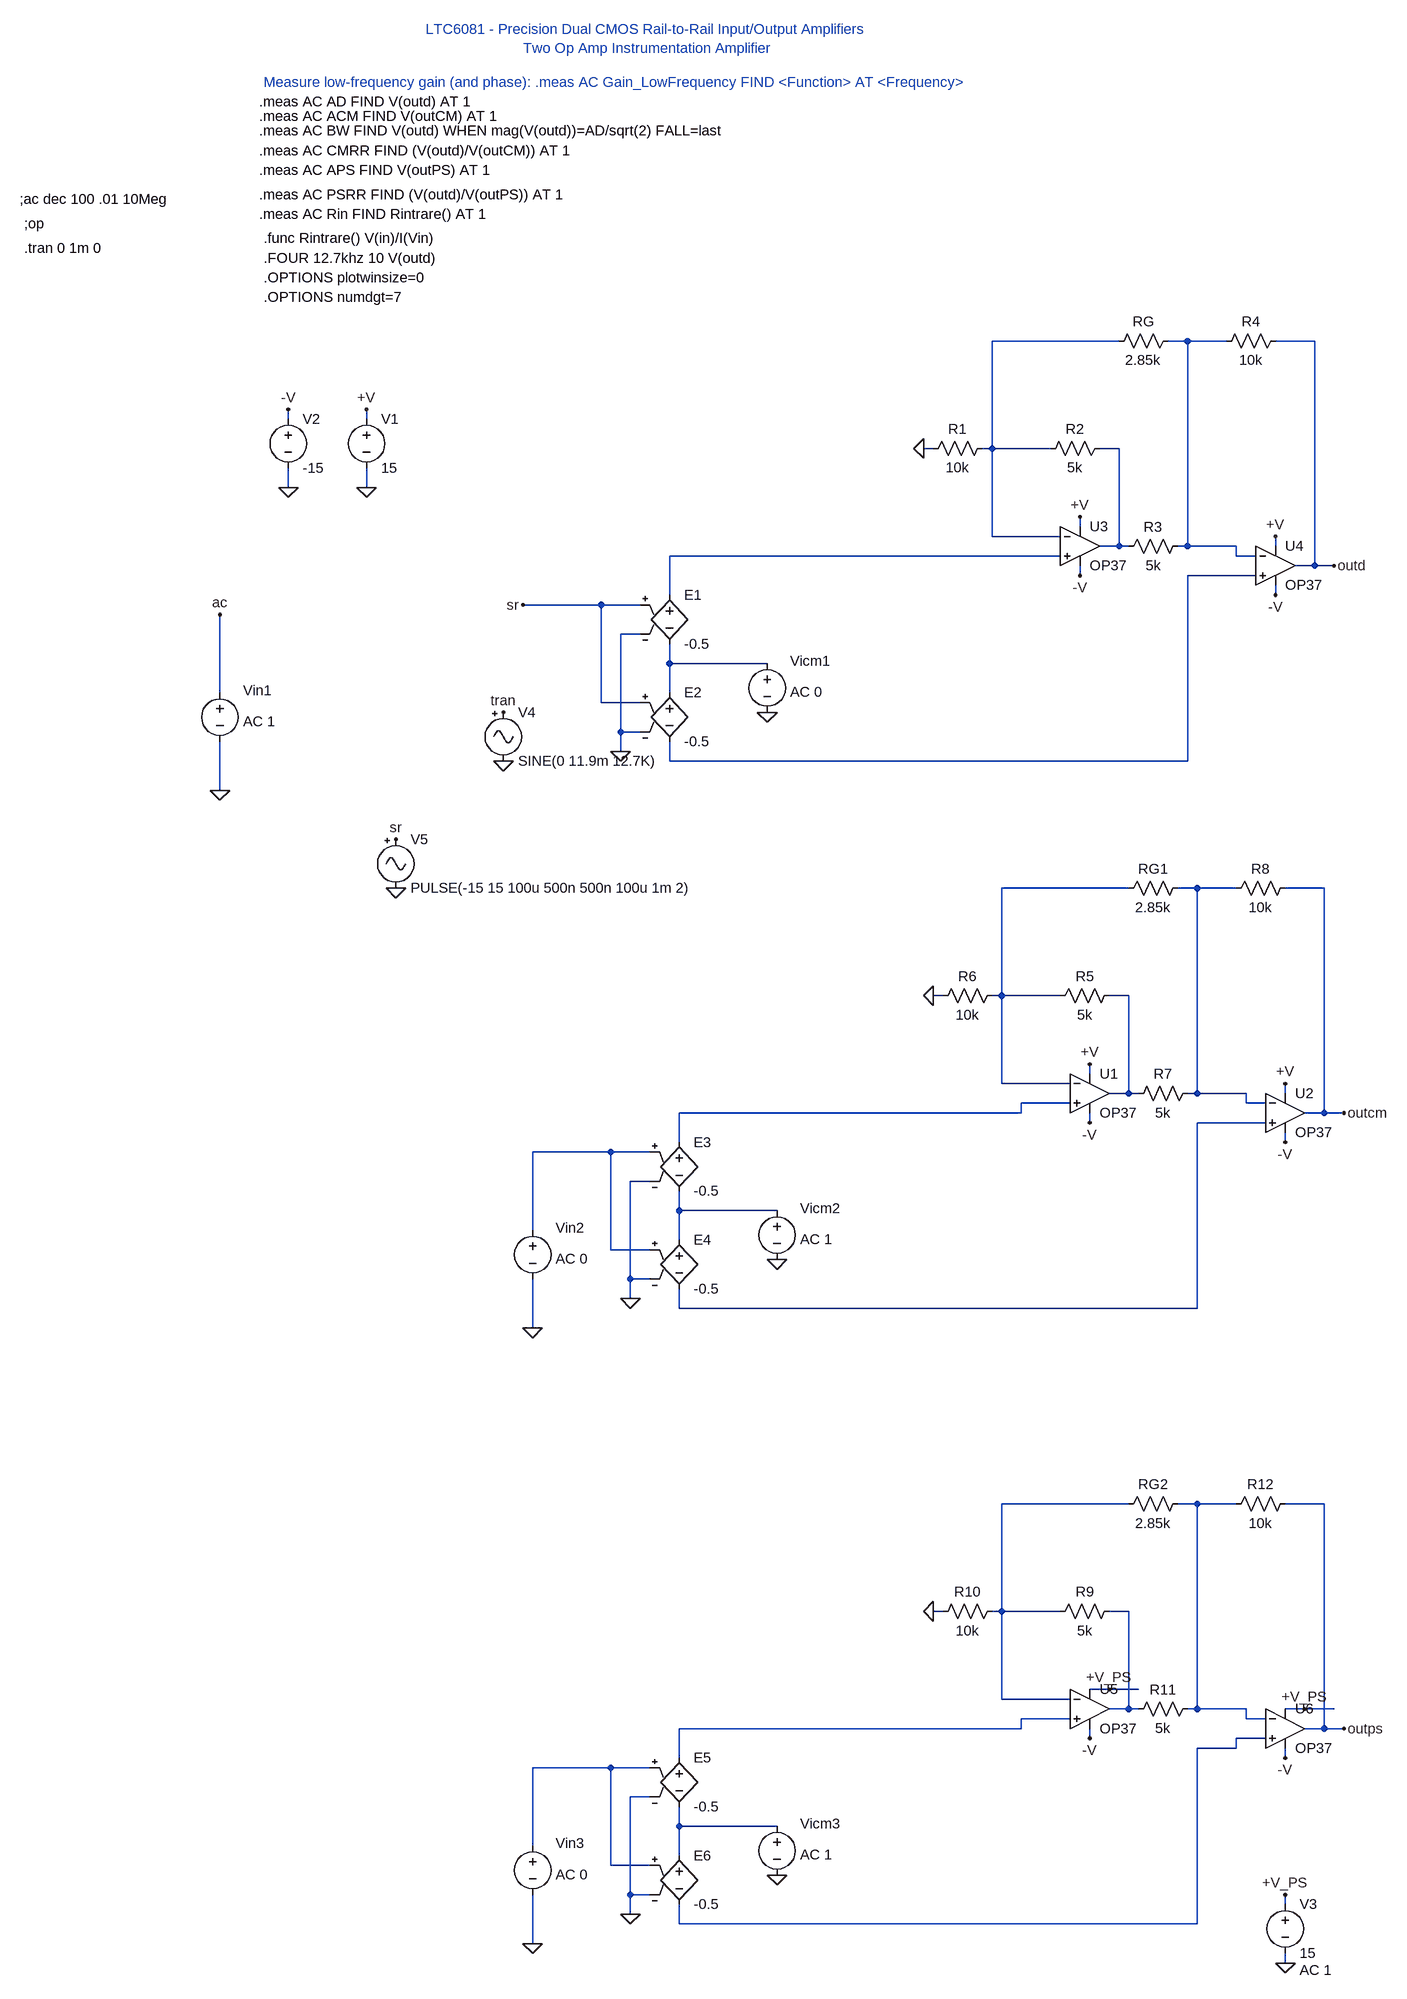
[diagram p0: schematic ai.asc]
ai.asc, the LTspice schematic file:
Version 4
SHEET 1 1248 2588
WIRE 272 -96 64 -96
WIRE 384 -96 352 -96
WIRE 448 -96 384 -96
WIRE 592 -96 528 -96
WIRE -1088 32 -1088 16
WIRE -960 32 -960 16
WIRE -32 80 -48 80
WIRE 64 80 64 -96
WIRE 64 80 48 80
WIRE 160 80 64 80
WIRE 272 80 240 80
WIRE -1088 144 -1088 112
WIRE -960 144 -960 112
WIRE 208 208 208 192
WIRE 64 224 64 80
WIRE 176 224 64 224
WIRE 272 240 272 80
WIRE 272 240 240 240
WIRE 288 240 272 240
WIRE 384 240 384 -96
WIRE 384 240 368 240
WIRE 464 240 384 240
WIRE 528 240 528 224
WIRE 176 256 -464 256
WIRE 464 256 464 240
WIRE 496 256 464 256
WIRE 592 272 592 -96
WIRE 592 272 560 272
WIRE 624 272 592 272
WIRE 208 288 208 272
WIRE 496 288 384 288
WIRE -464 320 -464 256
WIRE 528 320 528 304
WIRE -576 336 -704 336
WIRE -512 336 -576 336
WIRE -512 384 -544 384
WIRE -464 432 -464 400
WIRE -304 432 -464 432
WIRE -1200 480 -1200 352
WIRE -464 480 -464 432
WIRE -576 496 -576 336
WIRE -512 496 -576 496
WIRE -544 544 -544 384
WIRE -512 544 -544 544
WIRE -544 576 -544 544
WIRE -464 592 -464 560
WIRE 384 592 384 288
WIRE 384 592 -464 592
WIRE -1200 640 -1200 560
WIRE 288 800 80 800
WIRE 400 800 368 800
WIRE 464 800 400 800
WIRE 608 800 544 800
WIRE -16 976 -32 976
WIRE 80 976 80 800
WIRE 80 976 64 976
WIRE 176 976 80 976
WIRE 288 976 256 976
WIRE 224 1104 224 1088
WIRE 80 1120 80 976
WIRE 192 1120 80 1120
WIRE 288 1136 288 976
WIRE 288 1136 256 1136
WIRE 304 1136 288 1136
WIRE 400 1136 400 800
WIRE 400 1136 384 1136
WIRE 480 1136 400 1136
WIRE 544 1136 544 1120
WIRE 192 1152 112 1152
WIRE 480 1152 480 1136
WIRE 512 1152 480 1152
WIRE 112 1168 112 1152
WIRE 112 1168 -448 1168
WIRE 608 1168 608 800
WIRE 608 1168 576 1168
WIRE 640 1168 608 1168
WIRE 224 1184 224 1168
WIRE 512 1184 400 1184
WIRE -448 1216 -448 1168
WIRE 544 1216 544 1200
WIRE -560 1232 -688 1232
WIRE -496 1232 -560 1232
WIRE -496 1280 -528 1280
WIRE -448 1328 -448 1296
WIRE -288 1328 -448 1328
WIRE -688 1360 -688 1232
WIRE -448 1376 -448 1328
WIRE -560 1392 -560 1232
WIRE -496 1392 -560 1392
WIRE -528 1440 -528 1280
WIRE -496 1440 -528 1440
WIRE -528 1472 -528 1440
WIRE -448 1488 -448 1456
WIRE 400 1488 400 1184
WIRE 400 1488 -448 1488
WIRE -688 1520 -688 1440
WIRE 288 1808 80 1808
WIRE 400 1808 368 1808
WIRE 464 1808 400 1808
WIRE 608 1808 544 1808
WIRE -16 1984 -32 1984
WIRE 80 1984 80 1808
WIRE 80 1984 64 1984
WIRE 176 1984 80 1984
WIRE 288 1984 256 1984
WIRE 256 2112 224 2112
WIRE 304 2112 256 2112
WIRE 80 2128 80 1984
WIRE 192 2128 80 2128
WIRE 288 2144 288 1984
WIRE 288 2144 256 2144
WIRE 304 2144 288 2144
WIRE 400 2144 400 1808
WIRE 400 2144 384 2144
WIRE 480 2144 400 2144
WIRE 576 2144 544 2144
WIRE 624 2144 576 2144
WIRE 192 2160 112 2160
WIRE 480 2160 480 2144
WIRE 512 2160 480 2160
WIRE 112 2176 112 2160
WIRE 112 2176 -448 2176
WIRE 608 2176 608 1808
WIRE 608 2176 576 2176
WIRE 640 2176 608 2176
WIRE 224 2192 224 2176
WIRE 512 2192 464 2192
WIRE 464 2208 464 2192
WIRE 464 2208 400 2208
WIRE -448 2224 -448 2176
WIRE 544 2224 544 2208
WIRE -560 2240 -688 2240
WIRE -496 2240 -560 2240
WIRE -496 2288 -528 2288
WIRE -448 2336 -448 2304
WIRE -288 2336 -448 2336
WIRE -688 2368 -688 2240
WIRE -448 2384 -448 2336
WIRE -560 2400 -560 2240
WIRE -496 2400 -560 2400
WIRE -528 2448 -528 2288
WIRE -496 2448 -528 2448
WIRE 544 2464 544 2448
WIRE -528 2480 -528 2448
WIRE -448 2496 -448 2464
WIRE 400 2496 400 2208
WIRE 400 2496 -448 2496
WIRE -688 2528 -688 2448
WIRE 544 2560 544 2544
FLAG -960 144 0
FLAG 208 192 +V
FLAG -960 16 +V
FLAG 208 288 -V
FLAG -1088 144 0
FLAG -1088 16 -V
FLAG -48 80 0
FLAG 528 224 +V
FLAG 528 320 -V
FLAG 624 272 outd
FLAG -1200 640 0
FLAG -544 576 0
FLAG -304 512 0
FLAG 224 1088 +V
FLAG 224 1184 -V
FLAG -32 976 0
FLAG 544 1120 +V
FLAG 544 1216 -V
FLAG 640 1168 outcm
FLAG -688 1520 0
FLAG -528 1472 0
FLAG -288 1408 0
FLAG 224 2192 -V
FLAG -32 1984 0
FLAG 544 2224 -V
FLAG 640 2176 outps
FLAG -688 2528 0
FLAG -528 2480 0
FLAG -288 2416 0
FLAG 544 2560 0
FLAG 544 2448 +V_PS
FLAG 576 2144 +V_PS
FLAG 256 2112 +V_PS
FLAG -1200 352 ac
FLAG -736 512 tran
FLAG -736 592 0
FLAG -912 800 0
FLAG -912 720 sr
FLAG -704 336 sr
SYMBOL voltage -960 16 R0
WINDOW 123 0 0 Left 2
WINDOW 39 0 0 Left 2
SYMATTR InstName V1
SYMATTR Value 15
SYMBOL voltage -1088 16 R0
WINDOW 123 0 0 Left 2
WINDOW 39 0 0 Left 2
SYMATTR InstName V2
SYMATTR Value -15
SYMBOL res 256 64 R90
WINDOW 0 0 56 VBottom 2
WINDOW 3 32 56 VTop 2
SYMATTR InstName R2
SYMATTR Value 5k
SYMBOL res 64 64 R90
WINDOW 0 0 56 VBottom 2
WINDOW 3 32 56 VTop 2
SYMATTR InstName R1
SYMATTR Value 10k
SYMBOL res 368 -112 R90
WINDOW 0 0 56 VBottom 2
WINDOW 3 32 56 VTop 2
SYMATTR InstName RG
SYMATTR Value 2.85k
SYMBOL res 384 224 R90
WINDOW 0 0 56 VBottom 2
WINDOW 3 32 56 VTop 2
SYMATTR InstName R3
SYMATTR Value 5k
SYMBOL res 544 -112 R90
WINDOW 0 0 56 VBottom 2
WINDOW 3 32 56 VTop 2
SYMATTR InstName R4
SYMATTR Value 10k
SYMBOL voltage -1200 464 R0
WINDOW 123 38 63 Left 2
WINDOW 39 0 0 Left 2
WINDOW 0 38 12 Left 2
WINDOW 3 -188 38 Left 2
SYMATTR Value2 AC 1
SYMATTR InstName Vin1
SYMATTR Value ""
SYMBOL e -464 304 R0
SYMATTR InstName E1
SYMATTR Value -0.5
SYMBOL e -464 464 R0
SYMATTR InstName E2
SYMATTR Value -0.5
SYMBOL voltage -304 416 R0
WINDOW 123 38 63 Left 2
WINDOW 39 0 0 Left 2
WINDOW 0 38 12 Left 2
WINDOW 3 -188 38 Left 2
SYMATTR Value2 AC 0
SYMATTR InstName Vicm1
SYMATTR Value ""
SYMBOL res 272 960 R90
WINDOW 0 0 56 VBottom 2
WINDOW 3 32 56 VTop 2
SYMATTR InstName R5
SYMATTR Value 5k
SYMBOL res 80 960 R90
WINDOW 0 0 56 VBottom 2
WINDOW 3 32 56 VTop 2
SYMATTR InstName R6
SYMATTR Value 10k
SYMBOL res 384 784 R90
WINDOW 0 0 56 VBottom 2
WINDOW 3 32 56 VTop 2
SYMATTR InstName RG1
SYMATTR Value 2.85k
SYMBOL res 400 1120 R90
WINDOW 0 0 56 VBottom 2
WINDOW 3 32 56 VTop 2
SYMATTR InstName R7
SYMATTR Value 5k
SYMBOL res 560 784 R90
WINDOW 0 0 56 VBottom 2
WINDOW 3 32 56 VTop 2
SYMATTR InstName R8
SYMATTR Value 10k
SYMBOL voltage -688 1344 R0
WINDOW 123 38 63 Left 2
WINDOW 39 0 0 Left 2
WINDOW 0 38 12 Left 2
WINDOW 3 -188 38 Left 2
SYMATTR Value2 AC 0
SYMATTR InstName Vin2
SYMATTR Value ""
SYMBOL e -448 1200 R0
SYMATTR InstName E3
SYMATTR Value -0.5
SYMBOL e -448 1360 R0
SYMATTR InstName E4
SYMATTR Value -0.5
SYMBOL voltage -288 1312 R0
WINDOW 123 38 63 Left 2
WINDOW 39 0 0 Left 2
WINDOW 0 38 12 Left 2
WINDOW 3 -188 38 Left 2
SYMATTR Value2 AC 1
SYMATTR InstName Vicm2
SYMATTR Value ""
SYMBOL res 272 1968 R90
WINDOW 0 0 56 VBottom 2
WINDOW 3 32 56 VTop 2
SYMATTR InstName R9
SYMATTR Value 5k
SYMBOL res 80 1968 R90
WINDOW 0 0 56 VBottom 2
WINDOW 3 32 56 VTop 2
SYMATTR InstName R10
SYMATTR Value 10k
SYMBOL res 384 1792 R90
WINDOW 0 0 56 VBottom 2
WINDOW 3 32 56 VTop 2
SYMATTR InstName RG2
SYMATTR Value 2.85k
SYMBOL res 400 2128 R90
WINDOW 0 0 56 VBottom 2
WINDOW 3 32 56 VTop 2
SYMATTR InstName R11
SYMATTR Value 5k
SYMBOL res 560 1792 R90
WINDOW 0 0 56 VBottom 2
WINDOW 3 32 56 VTop 2
SYMATTR InstName R12
SYMATTR Value 10k
SYMBOL voltage -688 2352 R0
WINDOW 123 38 63 Left 2
WINDOW 39 0 0 Left 2
WINDOW 0 38 12 Left 2
WINDOW 3 -188 38 Left 2
SYMATTR Value2 AC 0
SYMATTR InstName Vin3
SYMATTR Value ""
SYMBOL e -448 2208 R0
SYMATTR InstName E5
SYMATTR Value -0.5
SYMBOL e -448 2368 R0
SYMATTR InstName E6
SYMATTR Value -0.5
SYMBOL voltage -288 2320 R0
WINDOW 123 38 63 Left 2
WINDOW 39 0 0 Left 2
WINDOW 0 38 12 Left 2
WINDOW 3 -188 38 Left 2
SYMATTR Value2 AC 1
SYMATTR InstName Vicm3
SYMATTR Value ""
SYMBOL voltage 544 2448 R0
WINDOW 123 24 124 Left 2
WINDOW 39 0 0 Left 2
SYMATTR Value2 AC 1
SYMATTR InstName V3
SYMATTR Value 15
SYMBOL OpAmps\\OP37 208 176 R0
SYMATTR InstName U3
SYMBOL OpAmps\\OP37 528 208 R0
SYMATTR InstName U4
SYMBOL OpAmps\\OP37 224 1072 R0
SYMATTR InstName U1
SYMBOL OpAmps\\OP37 544 1104 R0
SYMATTR InstName U2
SYMBOL OpAmps\\OP37 224 2080 R0
SYMATTR InstName U5
SYMBOL OpAmps\\OP37 544 2112 R0
SYMATTR InstName U6
SYMBOL Misc\\signal -736 496 R0
WINDOW 123 0 0 Left 0
WINDOW 39 0 0 Left 0
SYMATTR InstName V4
SYMATTR Value SINE(0 11.9m 12.7K)
SYMBOL Misc\\signal -912 704 R0
WINDOW 123 0 0 Left 0
WINDOW 39 0 0 Left 0
SYMATTR InstName V5
SYMATTR Value PULSE(-15 15 100u 500n 500n 100u 1m 2)
TEXT -496 -560 Bottom 2 ;LTC6081 - Precision Dual CMOS Rail-to-Rail Input/Output Amplifiers\nTwo Op Amp Instrumentation Amplifier
TEXT -1528 -328 Left 2 !;ac dec 100 .01 10Meg
TEXT -1136 -488 Left 2 !.meas AC AD FIND V(outd) AT 1
TEXT -1128 -520 Left 2 ;Measure low-frequency gain (and phase): .meas AC Gain_LowFrequency FIND <Function> AT <Frequency>
TEXT -1136 -464 Left 2 !.meas AC ACM FIND V(outCM) AT 1
TEXT -1136 -440 Left 2 !.meas AC BW FIND V(outd) WHEN mag(V(outd))=AD/sqrt(2) FALL=last
TEXT -1136 -408 Left 2 !.meas AC CMRR FIND (V(outd)/V(outCM)) AT 1
TEXT -1136 -336 Left 2 !.meas AC PSRR FIND (V(outd)/V(outPS)) AT 1
TEXT -1136 -376 Left 2 !.meas AC APS FIND V(outPS) AT 1
TEXT -1520 -288 Left 2 !;op
TEXT -1520 -248 Left 2 !.tran 0 1m 0
TEXT -1128 -232 Left 2 !.FOUR 12.7khz 10 V(outd)
TEXT -1128 -200 Left 2 !.OPTIONS plotwinsize=0
TEXT -1128 -168 Left 2 !.OPTIONS numdgt=7
TEXT -1136 -304 Left 2 !.meas AC Rin FIND Rintrare() AT 1
TEXT -1128 -264 Left 2 !.func Rintrare() V(in)/I(Vin)

The netlist it stands for:
* ai.asc
V1 +V 0 15
V2 -V 0 -15
R2 N003 N001 5k
R1 N001 0 10k
RG N002 N001 2.85k
R3 N002 N003 5k
R4 outd N002 10k
Vin1 ac 0 AC 1
E1 N004 N006 sr 0 -0.5
E2 N006 N005 sr 0 -0.5
Vicm1 N006 0 AC 0
R5 N009 N007 5k
R6 N007 0 10k
RG1 N008 N007 2.85k
R7 N008 N009 5k
R8 outcm N008 10k
Vin2 N012 0 AC 0
E3 N010 N013 N012 0 -0.5
E4 N013 N011 N012 0 -0.5
Vicm2 N013 0 AC 1
R9 N016 N014 5k
R10 N014 0 10k
RG2 N015 N014 2.85k
R11 N015 N016 5k
R12 outps N015 10k
Vin3 N019 0 AC 0
E5 N017 N020 N019 0 -0.5
E6 N020 N018 N019 0 -0.5
Vicm3 N020 0 AC 1
V3 +V_PS 0 15 AC 1
XU3 N004 N001 +V -V N003 LT1037  ; OP37, pins In+ In- V+ V- OUT
XU4 N005 N002 +V -V outd LT1037  ; OP37, pins In+ In- V+ V- OUT
XU1 N010 N007 +V -V N009 LT1037  ; OP37, pins In+ In- V+ V- OUT
XU2 N011 N008 +V -V outcm LT1037  ; OP37, pins In+ In- V+ V- OUT
XU5 N017 N014 +V_PS -V N016 LT1037  ; OP37, pins In+ In- V+ V- OUT
XU6 N018 N015 +V_PS -V outps LT1037  ; OP37, pins In+ In- V+ V- OUT
V4 tran 0 SINE(0 11.9m 12.7K)
V5 sr 0 PULSE(-15 15 100u 500n 500n 100u 1m 2)
* LTC6081 - Precision Dual CMOS Rail-to-Rail Input/Output Amplifiers
* Two Op Amp Instrumentation Amplifier
;ac dec 100 .01 10Meg
.meas AC AD FIND V(outd) AT 1
* Measure low-frequency gain (and phase): .meas AC Gain_LowFrequency FIND <Function> AT <Frequency>
.meas AC ACM FIND V(outCM) AT 1
.meas AC BW FIND V(outd) WHEN mag(V(outd))=AD/sqrt(2) FALL=last
.meas AC CMRR FIND (V(outd)/V(outCM)) AT 1
.meas AC PSRR FIND (V(outd)/V(outPS)) AT 1
.meas AC APS FIND V(outPS) AT 1
;op
.tran 0 1m 0
.FOUR 12.7khz 10 V(outd)
.OPTIONS plotwinsize=0
.OPTIONS numdgt=7
.meas AC Rin FIND Rintrare() AT 1
.func Rintrare() V(in)/I(Vin)
.lib LTC.lib
.backanno
.end

* Results of the author's LTspice run, read from the files saved beside the schematic
* Operating Point, zero values left out:
*   V(+v) = 15 V
*   V(-v) = -15 V
*   V(+v_ps) = 15 V
*   V(sr) = -15 V
*   I(V1) = -11.87 mA
*   I(V2) = 17.81 mA
*   I(V3) = -5.935 mA
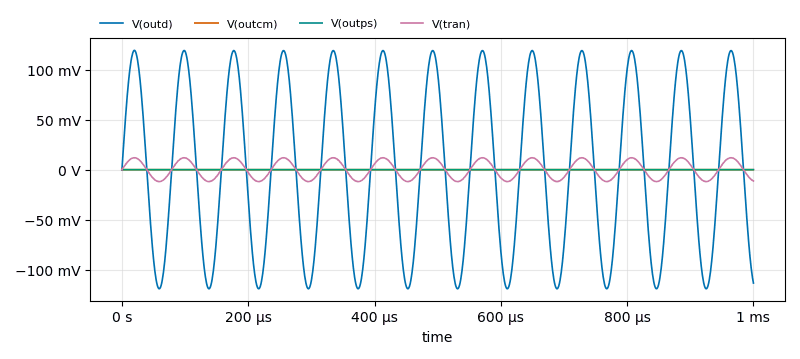
[diagram p1: Transient Analysis of ai.asc, plotted from the saved traces]
* Transient Analysis, 1 run:
*   V(outd): min -119 mV, max 119.2 mV, average 1.957 mV, rms 84.01 mV, last -113.3 mV
*   V(outcm): min -0.2698 fV, max 0.6178 fV, average -0.01654 fV, rms 0.03695 fV, last -0.01464 fV
*   V(outps): min -0.4406 fV, max 1.832 fV, average -0.01843 fV, rms 0.03474 fV, last -0.008355 fV
*   V(tran): min -11.9 mV, max 11.9 mV, average 195.2 µV, rms 8.399 mV, last -11.32 mV
* From the log:
*   N-Period=1
*   Fourier components of V(outd)
*   DC component:-1.5849e-06
*   Harmonic  Frequency   Fourier   Normalized   Phase    Normalized
*    Number     [Hz]     Component   Component  [degree]  Phase [deg]
*       1      1.270e+4   1.190e-1   1.000e+0     90.12°      0.00°
*       2      2.540e+4   3.165e-6   2.661e-5    -39.97°   -130.09°
*       3      3.810e+4   3.160e-6   2.656e-5   -149.96°   -240.08°
*       4      5.080e+4   3.152e-6   2.650e-5    100.06°      9.94°
*       5      6.350e+4   3.142e-6   2.641e-5     -9.92°   -100.04°
*       6      7.620e+4   3.131e-6   2.631e-5   -119.89°   -210.01°
*       7      8.890e+4   3.117e-6   2.620e-5    130.15°     40.03°
*       8      1.016e+5   3.100e-6   2.606e-5     20.20°    -69.92°
*       9      1.143e+5   3.082e-6   2.591e-5    -89.75°   -179.87°
*      10      1.270e+5   3.062e-6   2.574e-5    160.32°     70.20°
*   Partial Harmonic Distortion: 0.007877%
*   Total Harmonic Distortion:   0.027849%